# EAGLE schematic Waveform_Gen_V1.0 (EAGLE 9.0.1)
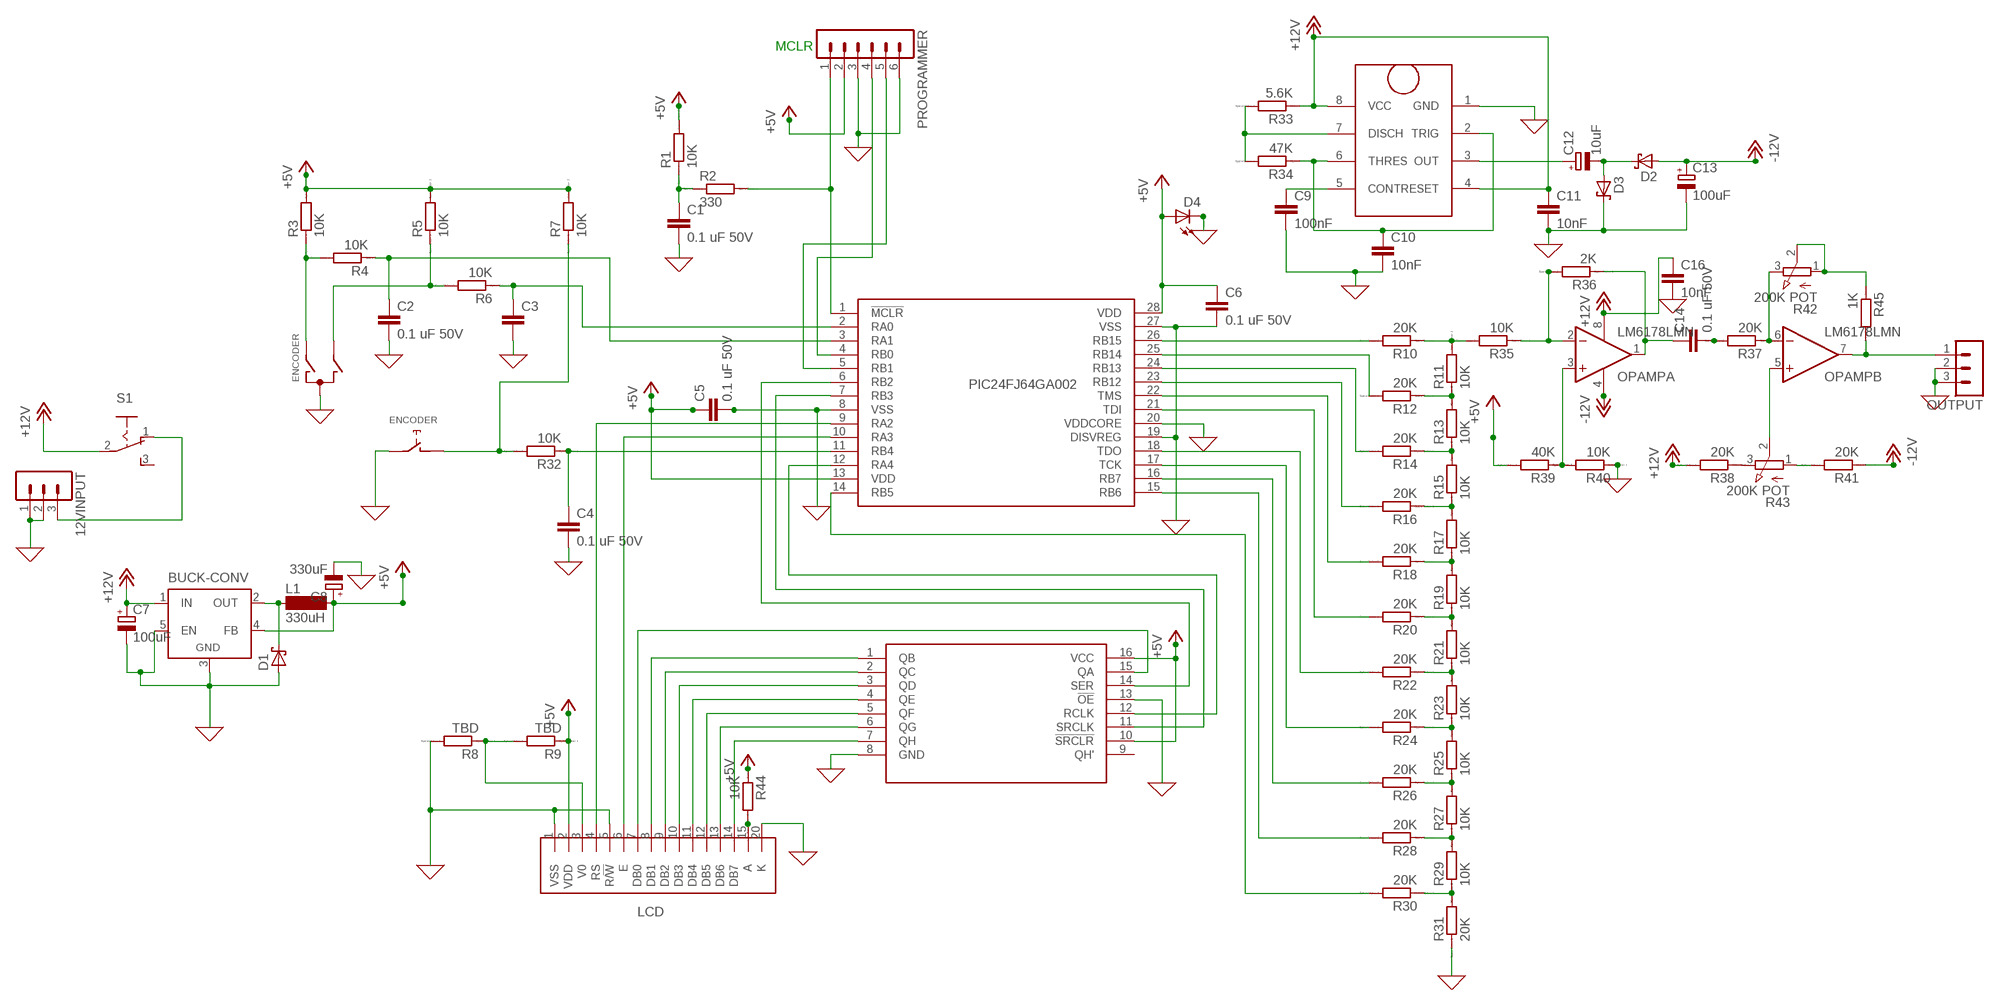
[diagram p0: schematic, sheet 1]

## Parts
12VINPUT  MA03-1  [MA03-1]
BUCK-CONV  LM2596TH  [TO220-52]
C1  0.1 uF 50V  C5/2.5  [C5B2.5]
C2  0.1 uF 50V  C5/2.5  [C5B2.5]
C3  C5/2.5  [C5B2.5]
C4  0.1 uF 50V  C5/2.5  [C5B2.5]
C5  0.1 uF 50V  C5/2.5  [C5B2.5]
C6  0.1 uF 50V  C5/2.5  [C5B2.5]
C7  100uF  CPOL-EUE3.5-8  [E3,5-8]
C8  330uF  CPOL-EUE3.5-10  [E3,5-10]
C9  100nF  C5/2.5  [C5B2.5]
C10  10nF  C5/2.5  [C5B2.5]
C11  10nF  C5/2.5  [C5B2.5]
C12  10uF  CPOL-EUE2,5-6E  [E2,5-6E]
C13  100uF  CPOL-EUE3.5-8  [E3,5-8]
C14  0.1 uF 50V  C5/2.5  [C5B2.5]
C16  10nF  C5/2.5  [C5B2.5]
D1  SCHOTTKY-DIODETO92H  [TO92H]
D2  SCHOTTKY-DIODETO92H  [TO92H]
D3  SCHOTTKY-DIODETO92H  [TO92H]
D4  SFH482  [SFH482]
ENCODER  EC12E_SW  [ALPS_EC12E_SW]
IC555  IC555  [DIL08]
L1  330uH  SD12K100  [SD12K100]
LCD  LCD_PIN  [SIL16]
OPAMP  LM6178LMN  [DIL08]
OUTPUT  MA03-1  [MA03-1]
PIC24FJ64GA002  PIC24FJ64GA002  [DIL28-3]
PROGRAMMER  MA06-1  [MA06-1]
R1  10K  R0207/10  [0207/10]
R2  330  R0207/10  [0207/10]
R3  10K  R0207/10  [0207/10]
R4  10K  R0207/10  [0207/10]
R5  10K  R0207/10  [0207/10]
R6  10K  R0207/10  [0207/10]
R7  10K  R0207/10  [0207/10]
R8  TBD  R0207/10  [0207/10]
R9  TBD  R0207/10  [0207/10]
R10  20K  R0207/10  [0207/10]
R11  10K  R0207/10  [0207/10]
R12  20K  R0207/10  [0207/10]
R13  10K  R0207/10  [0207/10]
R14  20K  R0207/10  [0207/10]
R15  10K  R0207/10  [0207/10]
R16  20K  R0207/10  [0207/10]
R17  10K  R0207/10  [0207/10]
R18  20K  R0207/10  [0207/10]
R19  10K  R0207/10  [0207/10]
R20  20K  R0207/10  [0207/10]
R21  10K  R0207/10  [0207/10]
R22  20K  R0207/10  [0207/10]
R23  10K  R0207/10  [0207/10]
R24  20K  R0207/10  [0207/10]
R25  10K  R0207/10  [0207/10]
R26  20K  R0207/10  [0207/10]
R27  10K  R0207/10  [0207/10]
R28  20K  R0207/10  [0207/10]
R29  10K  R0207/10  [0207/10]
R30  20K  R0207/10  [0207/10]
R31  20K  R0207/10  [0207/10]
R32  10K  R0207/10  [0207/10]
R33  5.6K  R0207/10  [0207/10]
R34  47K  R0207/10  [0207/10]
R35  10K  R0207/10  [0207/10]
R36  2K  R0207/10  [0207/10]
R37  20K  R0207/10  [0207/10]
R38  20K  R0207/10  [0207/10]
R39  40K  R0207/10  [0207/10]
R40  10K  R0207/10  [0207/10]
R41  20K  R0207/10  [0207/10]
R42  200K POT  EVUF2A  [EVUF]
R43  200K POT  EVUF2A  [EVUF]
R44  10K  R0207/10  [0207/10]
R45  1K  R0207/10  [0207/10]
S1  255SB  [255SB]
SHIFT-REG  74HC595  [DIL16]

## Nets
+5V: BUCK-CONV.4(FB) C5.1 C6.1 C8.+ D4.A L1.2 LCD.2(VDD) PIC24FJ64GA002.13(VDD) PIC24FJ64GA002.28(VDD) PROGRAMMER.2 R1.2 R3.2 R5.2 R7.2 R9.1 R39.2 R44.1 SHIFT-REG.10(!SRCLR) SHIFT-REG.16(VCC)
+12V: BUCK-CONV.1(IN) C7.+ C11.1 C16.1 IC555.4(RESET) IC555.8(VCC) OPAMP.8(P:V+) R33.1 R38.2 S1.2(P)
-12V: C13.+ D2.1(A) OPAMP.4(P:V-) R41.1
GND: 12VINPUT.1 12VINPUT.2 BUCK-CONV.3(GND) BUCK-CONV.5(EN) C1.2 C2.2 C3.2 C4.2 C5.2 C6.2 C7.- C8.- C9.2 C10.2 C11.2 C13.- C16.2 D1.1(A) D3.2(C) D4.K(C) ENCODER.C ENCODER.E IC555.1(GND) LCD.1(VSS) LCD.5(R/!W) LCD.20(K) OUTPUT.2 OUTPUT.3 PIC24FJ64GA002.8(VSS) PIC24FJ64GA002.19(DISVREG) PIC24FJ64GA002.20(VDDCORE) PIC24FJ64GA002.27(VSS) PROGRAMMER.3 PROGRAMMER.6 R8.2 R31.1 R40.1 SHIFT-REG.8(GND) SHIFT-REG.13(!OE)
N$1: PIC24FJ64GA002.7(RB3) SHIFT-REG.11(SRCLK)
N$2: PIC24FJ64GA002.6(RB2) SHIFT-REG.14(SER)
N$3: PIC24FJ64GA002.12(RA4) SHIFT-REG.12(RCLK)
N$4: R42.1(A) R42.2(S) R45.1
N$5: C3.1 PIC24FJ64GA002.2(RA0) R6.1
N$6: ENCODER.A R3.1 R4.2
N$7: PIC24FJ64GA002.1(!MCLR) PROGRAMMER.1 R2.2
N$8: C1.1 R1.1 R2.1
N$9: ENCODER.D R7.1 R32.2
N$10: PIC24FJ64GA002.26(RB15) R10.2
N$11: C2.1 PIC24FJ64GA002.3(RA1) R4.1
N$12: ENCODER.B R5.1 R6.2
N$13: C4.1 PIC24FJ64GA002.11(RB4) R32.1
N$14: PIC24FJ64GA002.4(RB0) PROGRAMMER.4
N$15: PIC24FJ64GA002.5(RB1) PROGRAMMER.5
N$17: R10.1 R11.2 R35.2
N$18: PIC24FJ64GA002.25(RB14) R12.2
N$19: R11.1 R12.1 R13.2
N$20: R13.1 R14.1 R15.2
N$21: R15.1 R16.1 R17.2
N$22: R17.1 R18.1 R19.2
N$23: R19.1 R20.1 R21.2
N$24: R21.1 R22.1 R23.2
N$25: R23.1 R24.1 R25.2
N$26: R25.1 R26.1 R27.2
N$27: R27.1 R28.1 R29.2
N$28: R29.1 R30.1 R31.2
N$29: PIC24FJ64GA002.24(RB13) R14.2
N$30: PIC24FJ64GA002.23(RB12) R16.2
N$31: PIC24FJ64GA002.22(TMS) R18.2
N$32: PIC24FJ64GA002.21(TDI) R20.2
N$33: PIC24FJ64GA002.18(TDO) R22.2
N$34: PIC24FJ64GA002.17(TCK) R24.2
N$35: PIC24FJ64GA002.16(RB7) R26.2
N$36: PIC24FJ64GA002.15(RB6) R28.2
N$37: LCD.7(DB0) SHIFT-REG.15(QA)
N$38: PIC24FJ64GA002.14(RB5) R30.2
N$39: LCD.8(DB1) SHIFT-REG.1(QB)
N$40: LCD.9(DB2) SHIFT-REG.2(QC)
N$41: LCD.10(DB3) SHIFT-REG.3(QD)
N$42: LCD.11(DB4) SHIFT-REG.4(QE)
N$43: LCD.12(DB5) SHIFT-REG.5(QF)
N$44: LCD.13(DB6) SHIFT-REG.6(QG)
N$45: LCD.14(DB7) SHIFT-REG.7(QH)
N$46: LCD.3(V0) R8.1 R9.2
N$47: LCD.4(RS) PIC24FJ64GA002.9(RA2)
N$48: LCD.6(E) PIC24FJ64GA002.10(RA3)
N$49: BUCK-CONV.2(OUT) D1.2(C) L1.1
N$50: LCD.15(A) R44.2
N$52: C10.1 IC555.2(TRIG) IC555.6(THRES) R34.1
N$53: C12.- D2.2(C) D3.1(A)
N$54: C9.1 IC555.5(CONT)
N$57: IC555.7(DISCH) R33.2 R34.2
N$58: C12.+ IC555.3(OUT)
N$60: OPAMP.2(A:-IN) R35.1 R36.2
N$61: C14.1 OPAMP.1(A:OUT) R36.1
N$62: OPAMP.3(A:+IN) R39.1 R40.2
N$63: OPAMP.6(B:-IN) R37.1 R42.3(E)
N$64: R38.1 R43.3(E)
N$65: OPAMP.7(B:OUT) OUTPUT.1 R45.2
N$67: OPAMP.5(B:+IN) R43.2(S)
N$68: R41.2 R43.1(A)
N$76: 12VINPUT.3 S1.1(O)
N$80: C14.2 R37.2
Unconnected: ENCODER.GND1(G) ENCODER.GND2(G) S1.3(S) SHIFT-REG.9(QH')

## Notes on the sheet
- MCLR

## Library data of the parts
12VINPUT OUTPUT = con-lstb:MA03-1: PIN HEADER; OC_FARNELL: unknown; OC_NEWARK: unknown
BUCK-CONV = linear:LM2596T: STEP-DOWN VOLTAGE REGULATOR
C1-C6 C9-C11 C14 C16 = capacitor-wima:C: CAPACITOR naming: grid - package width
C7 C8 C12 C13 = rcl:CPOL-EU: POLARIZED CAPACITOR, European symbol; SPICEPREFIX: C
D1-D3 = diode:SCHOTTKY-DIODE: Schottky Diode
D4 = led:SFH482: IR LED infrared emitting diode, Infineon
ENCODER = switch-alps:EC12E_SW: ALPS rotary Encoder EC12E series with switch; MPN: EC12E2424407; OC_FARNELL: 1520813; OC_NEWARK: 74M1068
IC555 = Waveform_Gen_V1.0:IC555
L1 = inductor-neosid:SD12: INDUCTOR nominal inductance; OC_FARNELL: unknown; OC_NEWARK: unknown
LCD = Waveform_Gen_V1.0:LCD_PIN
OPAMP = Waveform_Gen_V1.0:LM6178: OP AMP
PIC24FJ64GA002 = Waveform_Gen_V1.0:PIC24FJ64GA002: PIC24FJ256GA002; MPN: PIC24FJ64GA002-I/SP; OC_FARNELL: 1332298; OC_NEWARK: 88K6132
PROGRAMMER = con-lstb:MA06-1: PIN HEADER; OC_FARNELL: unknown; OC_NEWARK: unknown
R1-R41 R44 R45 = eagle-ltspice:R: RESISTOR, European symbol; SPICEMODEL: NONE; SPICEPREFIX: R
R42 R43 = pot:EVU: 9 mm Square Rotary Potentiometers Source: Panasonic
S1 = switch:255SB: SLIDING SWITCH Distributor Buerklin, 11G810
SHIFT-REG = Waveform_Gen_V1.0:74HC595